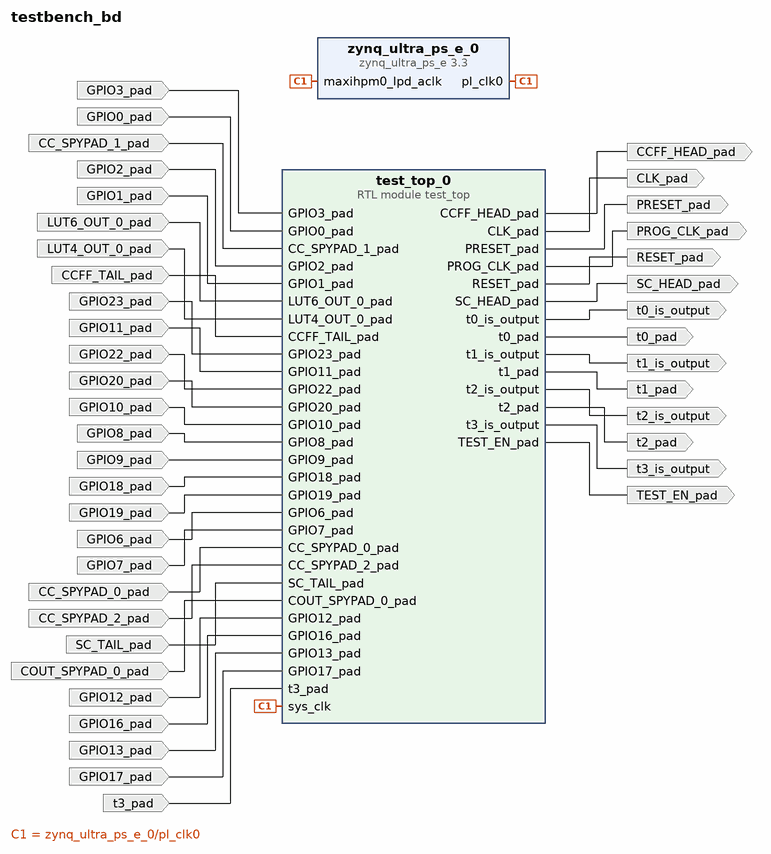
[diagram p0: block diagram of the top level]
# Vivado block design testbench_bd, xczu4eg-sfvc784-1-e, Vivado 2020.1
create_bd_design testbench_bd

create_bd_port -dir I GPIO3_pad
create_bd_port -dir I GPIO0_pad
create_bd_port -dir I CC_SPYPAD_1_pad
create_bd_port -dir I GPIO2_pad
create_bd_port -dir I GPIO1_pad
create_bd_port -dir I LUT6_OUT_0_pad
create_bd_port -dir I LUT4_OUT_0_pad
create_bd_port -dir I CCFF_TAIL_pad
create_bd_port -dir I GPIO23_pad
create_bd_port -dir I GPIO11_pad
create_bd_port -dir I GPIO22_pad
create_bd_port -dir I GPIO20_pad
create_bd_port -dir I GPIO10_pad
create_bd_port -dir I GPIO8_pad
create_bd_port -dir I GPIO9_pad
create_bd_port -dir I GPIO18_pad
create_bd_port -dir I GPIO19_pad
create_bd_port -dir I GPIO6_pad
create_bd_port -dir I GPIO7_pad
create_bd_port -dir I CC_SPYPAD_0_pad
create_bd_port -dir I CC_SPYPAD_2_pad
create_bd_port -dir I SC_TAIL_pad
create_bd_port -dir I COUT_SPYPAD_0_pad
create_bd_port -dir I GPIO12_pad
create_bd_port -dir I GPIO16_pad
create_bd_port -dir I GPIO13_pad
create_bd_port -dir I GPIO17_pad
create_bd_port -dir I t3_pad
create_bd_port -dir O -type rst RESET_pad
create_bd_port -dir O CLK_pad
create_bd_port -dir O SC_HEAD_pad
create_bd_port -dir O CCFF_HEAD_pad
create_bd_port -dir O PRESET_pad
create_bd_port -dir O PROG_CLK_pad
create_bd_port -dir O t0_pad
create_bd_port -dir O t1_pad
create_bd_port -dir O t2_pad
create_bd_port -dir O t0_is_output
create_bd_port -dir O t1_is_output
create_bd_port -dir O t2_is_output
create_bd_port -dir O t3_is_output
create_bd_port -dir O TEST_EN_pad

create_bd_cell -type ip -vlnv xilinx.com:ip:zynq_ultra_ps_e:3.3 zynq_ultra_ps_e_0
set_property -dict {CONFIG.PSU__DDR_HIGH_ADDRESS_GUI_ENABLE 0} [get_bd_cells zynq_ultra_ps_e_0]
# 2 more settings of zynq_ultra_ps_e_0 are not shown: defaults, MIO pin electricals, DDR timing, and values the tool derives
create_bd_cell -type module -reference test_top test_top_0

# ---- connections ----

connect_bd_net [get_bd_pins zynq_ultra_ps_e_0/pl_clk0] [get_bd_pins zynq_ultra_ps_e_0/maxihpm0_lpd_aclk] [get_bd_pins test_top_0/sys_clk]
connect_bd_net [get_bd_ports GPIO3_pad] [get_bd_pins test_top_0/GPIO3_pad]
connect_bd_net [get_bd_ports GPIO0_pad] [get_bd_pins test_top_0/GPIO0_pad]
connect_bd_net [get_bd_ports CC_SPYPAD_1_pad] [get_bd_pins test_top_0/CC_SPYPAD_1_pad]
connect_bd_net [get_bd_ports GPIO2_pad] [get_bd_pins test_top_0/GPIO2_pad]
connect_bd_net [get_bd_ports GPIO1_pad] [get_bd_pins test_top_0/GPIO1_pad]
connect_bd_net [get_bd_ports LUT6_OUT_0_pad] [get_bd_pins test_top_0/LUT6_OUT_0_pad]
connect_bd_net [get_bd_ports LUT4_OUT_0_pad] [get_bd_pins test_top_0/LUT4_OUT_0_pad]
connect_bd_net [get_bd_ports CCFF_TAIL_pad] [get_bd_pins test_top_0/CCFF_TAIL_pad]
connect_bd_net [get_bd_ports GPIO23_pad] [get_bd_pins test_top_0/GPIO23_pad]
connect_bd_net [get_bd_ports GPIO11_pad] [get_bd_pins test_top_0/GPIO11_pad]
connect_bd_net [get_bd_ports GPIO22_pad] [get_bd_pins test_top_0/GPIO22_pad]
connect_bd_net [get_bd_ports GPIO20_pad] [get_bd_pins test_top_0/GPIO20_pad]
connect_bd_net [get_bd_ports GPIO10_pad] [get_bd_pins test_top_0/GPIO10_pad]
connect_bd_net [get_bd_ports GPIO8_pad] [get_bd_pins test_top_0/GPIO8_pad]
connect_bd_net [get_bd_ports GPIO9_pad] [get_bd_pins test_top_0/GPIO9_pad]
connect_bd_net [get_bd_ports GPIO18_pad] [get_bd_pins test_top_0/GPIO18_pad]
connect_bd_net [get_bd_ports GPIO19_pad] [get_bd_pins test_top_0/GPIO19_pad]
connect_bd_net [get_bd_ports GPIO6_pad] [get_bd_pins test_top_0/GPIO6_pad]
connect_bd_net [get_bd_ports GPIO7_pad] [get_bd_pins test_top_0/GPIO7_pad]
connect_bd_net [get_bd_ports CC_SPYPAD_0_pad] [get_bd_pins test_top_0/CC_SPYPAD_0_pad]
connect_bd_net [get_bd_ports CC_SPYPAD_2_pad] [get_bd_pins test_top_0/CC_SPYPAD_2_pad]
connect_bd_net [get_bd_ports SC_TAIL_pad] [get_bd_pins test_top_0/SC_TAIL_pad]
connect_bd_net [get_bd_ports COUT_SPYPAD_0_pad] [get_bd_pins test_top_0/COUT_SPYPAD_0_pad]
connect_bd_net [get_bd_ports GPIO12_pad] [get_bd_pins test_top_0/GPIO12_pad]
connect_bd_net [get_bd_ports GPIO16_pad] [get_bd_pins test_top_0/GPIO16_pad]
connect_bd_net [get_bd_ports GPIO13_pad] [get_bd_pins test_top_0/GPIO13_pad]
connect_bd_net [get_bd_ports GPIO17_pad] [get_bd_pins test_top_0/GPIO17_pad]
connect_bd_net [get_bd_ports t3_pad] [get_bd_pins test_top_0/t3_pad]
connect_bd_net [get_bd_pins test_top_0/RESET_pad] [get_bd_ports RESET_pad]
connect_bd_net [get_bd_pins test_top_0/CLK_pad] [get_bd_ports CLK_pad]
connect_bd_net [get_bd_pins test_top_0/SC_HEAD_pad] [get_bd_ports SC_HEAD_pad]
connect_bd_net [get_bd_pins test_top_0/CCFF_HEAD_pad] [get_bd_ports CCFF_HEAD_pad]
connect_bd_net [get_bd_pins test_top_0/PRESET_pad] [get_bd_ports PRESET_pad]
connect_bd_net [get_bd_pins test_top_0/PROG_CLK_pad] [get_bd_ports PROG_CLK_pad]
connect_bd_net [get_bd_pins test_top_0/t0_pad] [get_bd_ports t0_pad]
connect_bd_net [get_bd_pins test_top_0/t1_pad] [get_bd_ports t1_pad]
connect_bd_net [get_bd_pins test_top_0/t2_pad] [get_bd_ports t2_pad]
connect_bd_net [get_bd_pins test_top_0/t0_is_output] [get_bd_ports t0_is_output]
connect_bd_net [get_bd_pins test_top_0/t1_is_output] [get_bd_ports t1_is_output]
connect_bd_net [get_bd_pins test_top_0/t2_is_output] [get_bd_ports t2_is_output]
connect_bd_net [get_bd_pins test_top_0/t3_is_output] [get_bd_ports t3_is_output]
connect_bd_net [get_bd_pins test_top_0/TEST_EN_pad] [get_bd_ports TEST_EN_pad]

validate_bd_design
save_bd_design
